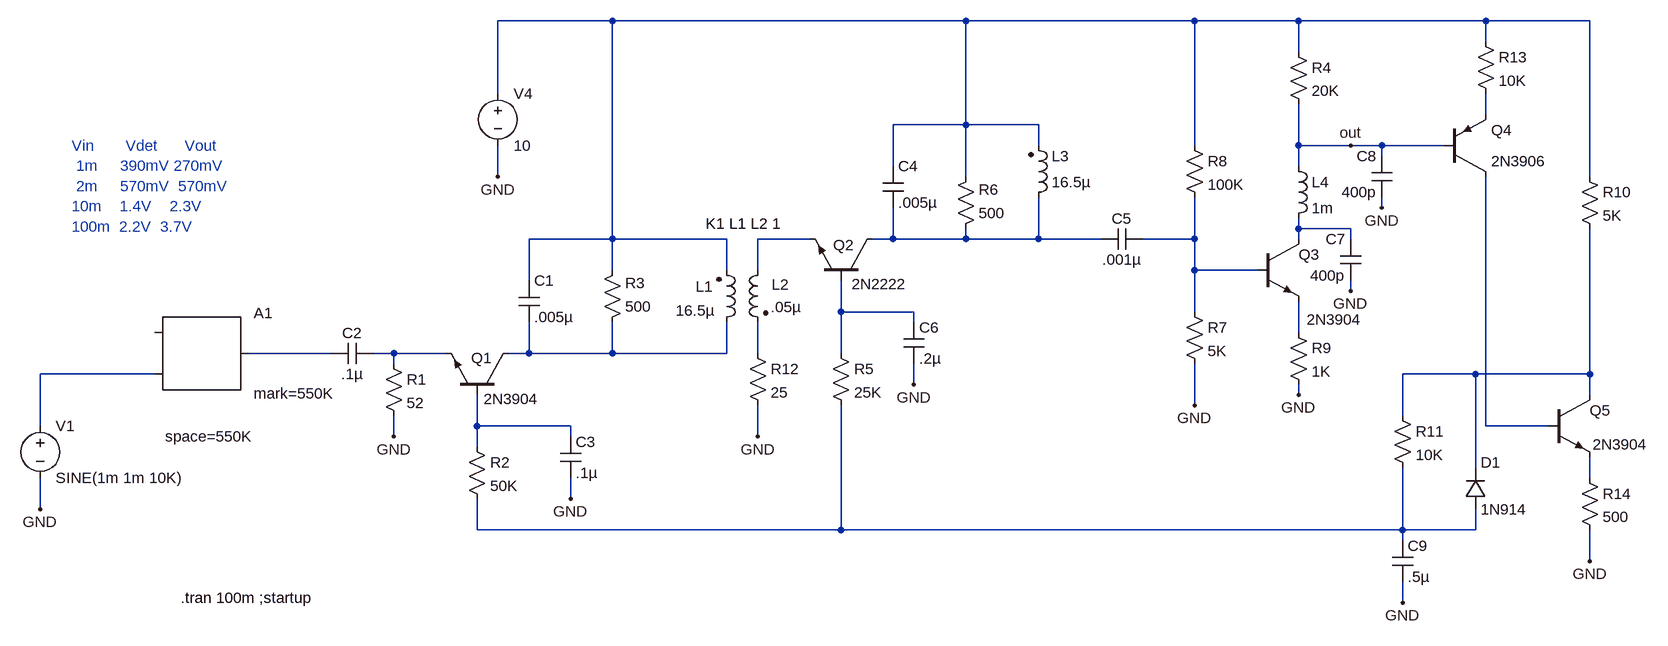
[diagram p0: schematic agc2.asc]
agc2.asc, the LTspice schematic file:
Version 4
SHEET 1 4068 1716
WIRE 2304 1312 2336 1312
WIRE 2640 1312 2640 1264
WIRE 2336 1312 2336 1264
WIRE 2336 1312 2464 1312
WIRE 2336 1136 2464 1136
WIRE 2640 1184 2640 1136
WIRE 2336 1200 2336 1136
WIRE 2208 1312 2128 1312
WIRE 2128 1312 2128 1328
WIRE 2128 1408 2128 1440
WIRE 2128 1312 2096 1312
WIRE 2032 1312 1904 1312
WIRE 1584 1344 1584 1424
WIRE 1584 1504 1584 1552
WIRE 2256 1376 2256 1424
WIRE 2256 1536 2256 1584
WIRE 2256 1424 2256 1456
WIRE 2256 1424 2400 1424
WIRE 2400 1424 2400 1440
WIRE 2400 1504 2400 1536
WIRE 2464 1136 2464 800
WIRE 2464 1136 2640 1136
WIRE 2464 1136 2464 1184
WIRE 2464 1264 2464 1312
WIRE 2464 1312 2640 1312
WIRE 2864 1136 2896 1136
WIRE 3120 1136 3120 1072
WIRE 2896 1136 2896 1088
WIRE 2896 1136 3008 1136
WIRE 2896 960 3008 960
WIRE 3120 992 3120 960
WIRE 2896 1024 2896 960
WIRE 2768 1136 2688 1136
WIRE 2816 1200 2816 1248
WIRE 2816 1248 2816 1312
WIRE 2816 1248 2928 1248
WIRE 2928 1248 2928 1264
WIRE 2928 1328 2928 1360
WIRE 3008 960 3120 960
WIRE 3008 960 3008 1040
WIRE 3008 1120 3008 1136
WIRE 3008 1136 3120 1136
WIRE 2688 1136 2688 1184
WIRE 2688 1264 2688 1312
WIRE 3520 1136 3520 1120
WIRE 3520 1024 3520 992
WIRE 2288 1040 2288 992
WIRE 2288 912 2288 800
WIRE 2288 800 2464 800
WIRE 3520 1376 3520 1360
WIRE 3520 848 3520 800
WIRE 3360 1328 3360 1392
WIRE 3360 1136 3280 1136
WIRE 3520 992 3600 992
WIRE 3520 992 3520 928
WIRE 3600 1216 3600 1200
WIRE 3520 1120 3520 1104
WIRE 3360 1136 3360 1072
WIRE 3520 1280 3520 1232
WIRE 3360 992 3360 800
WIRE 3360 1184 3360 1136
WIRE 3456 1184 3360 1184
WIRE 3360 1184 3360 1248
WIRE 2464 800 3008 800
WIRE 3008 800 3360 800
WIRE 3360 800 3520 800
WIRE 3600 1136 3600 1120
WIRE 3600 1120 3520 1120
WIRE 3680 1584 3680 1600
WIRE 3680 1664 3680 1696
WIRE 1760 1344 1584 1344
WIRE 2816 1392 2816 1584
WIRE 2816 1584 2256 1584
WIRE 3216 1136 3120 1136
WIRE 3808 944 3808 912
WIRE 3808 800 3520 800
WIRE 3808 1040 3808 1424
WIRE 3808 1424 3904 1424
WIRE 3968 1472 3968 1504
WIRE 3680 1584 3680 1488
WIRE 3968 1344 3968 1376
WIRE 3808 800 3968 800
WIRE 3968 800 3968 1040
WIRE 3968 1120 3968 1344
WIRE 3680 1408 3680 1344
WIRE 3808 832 3808 800
WIRE 3968 1584 3968 1632
WIRE 3600 992 3648 992
WIRE 3648 1088 3648 1072
WIRE 3648 1008 3648 992
WIRE 3648 992 3744 992
WIRE 2688 1392 2688 1440
WIRE 3680 1344 3792 1344
WIRE 3792 1344 3792 1488
WIRE 3792 1552 3792 1584
WIRE 3792 1584 3680 1584
WIRE 3008 960 3008 800
WIRE 3792 1344 3968 1344
WIRE 3680 1584 2816 1584
FLAG 2128 1440 GND
FLAG 1584 1552 GND
FLAG 2400 1536 GND
FLAG 2928 1360 GND
FLAG 2688 1440 GND
FLAG 3520 1376 GND
FLAG 2288 1040 GND
FLAG 3360 1392 GND
FLAG 3600 1216 GND
FLAG 3680 1696 GND
FLAG 3968 1632 GND
FLAG 3600 992 out
FLAG 3648 1088 GND
SYMBOL npn 2304 1376 M270
WINDOW 0 57 57 VLeft 0
WINDOW 3 -6 38 VLeft 0
SYMATTR InstName Q1
SYMATTR Value 2N3904
SYMBOL ind2 2624 1280 M180
WINDOW 0 -5 71 Right 0
WINDOW 3 -2 34 Right 0
SYMATTR InstName L1
SYMATTR Value 16.5µ
SYMBOL cap 2320 1264 M180
WINDOW 0 24 64 Left 0
WINDOW 3 24 8 Left 0
SYMATTR InstName C1
SYMATTR Value .005µ
SYMBOL res 2112 1312 R0
SYMATTR InstName R1
SYMATTR Value 52
SYMBOL cap 2096 1296 R90
WINDOW 0 0 32 VBottom 0
WINDOW 3 32 32 VTop 0
SYMATTR InstName C2
SYMATTR Value .1µ
SYMBOL voltage 1584 1408 R0
SYMATTR InstName V1
SYMATTR Value SINE(1m 1m 10K)
SYMBOL res 2240 1440 R0
SYMATTR InstName R2
SYMATTR Value 50K
SYMBOL cap 2384 1440 R0
SYMATTR InstName C3
SYMATTR Value .1µ
SYMBOL res 2448 1280 M180
WINDOW 0 36 76 Left 0
WINDOW 3 36 40 Left 0
SYMATTR InstName R3
SYMATTR Value 500
SYMBOL npn 2864 1200 M270
WINDOW 0 55 60 VLeft 0
WINDOW 3 -5 32 VLeft 0
SYMATTR InstName Q2
SYMATTR Value 2N2222
SYMBOL ind2 3104 1088 M180
WINDOW 0 36 80 Left 0
WINDOW 3 36 40 Left 0
SYMATTR InstName L3
SYMATTR Value 16.5µ
SYMBOL cap 2880 1088 M180
WINDOW 0 24 64 Left 0
WINDOW 3 24 8 Left 0
SYMATTR InstName C4
SYMATTR Value .005µ
SYMBOL res 2800 1296 R0
SYMATTR InstName R5
SYMATTR Value 25K
SYMBOL cap 2912 1264 R0
SYMATTR InstName C6
SYMATTR Value .2µ
SYMBOL res 2992 1136 M180
WINDOW 0 36 76 Left 0
WINDOW 3 36 40 Left 0
SYMATTR InstName R6
SYMATTR Value 500
SYMBOL ind2 2704 1168 M0
WINDOW 0 -5 38 Right 0
WINDOW 3 -4 73 Right 0
SYMATTR InstName L2
SYMATTR Value .05µ
SYMBOL ind 3504 1008 R0
SYMATTR InstName L4
SYMATTR Value 1m
SYMBOL voltage 2288 896 R0
SYMATTR InstName V4
SYMATTR Value 10
SYMBOL res 3504 832 R0
SYMATTR InstName R4
SYMATTR Value 20K
SYMBOL res 3344 1232 R0
SYMATTR InstName R7
SYMATTR Value 5K
SYMBOL cap 3280 1120 R90
WINDOW 0 0 32 VBottom 0
WINDOW 3 32 32 VTop 0
SYMATTR InstName C5
SYMATTR Value .001µ
SYMBOL cap 3616 1200 R180
WINDOW 0 24 64 Left 0
WINDOW 3 24 8 Left 0
SYMATTR InstName C7
SYMATTR Value 400p
SYMBOL npn 3456 1136 R0
WINDOW 0 64 24 Left 0
WINDOW 3 76 124 Left 0
SYMATTR InstName Q3
SYMATTR Value 2N3904
SYMBOL res 3344 976 R0
SYMATTR InstName R8
SYMATTR Value 100K
SYMBOL res 3504 1264 R0
SYMATTR InstName R9
SYMATTR Value 1K
SYMBOL res 3952 1024 R0
SYMATTR InstName R10
SYMATTR Value 5K
SYMBOL cap 3664 1600 R0
SYMATTR InstName C9
SYMATTR Value .5µ
SYMBOL SpecialFunctions\modulate 1760 1280 R0
WINDOW 123 16 160 Left 0
SYMATTR InstName A1
SYMATTR Value mark=550K
SYMATTR Value2 space=550K
SYMBOL pnp 3744 1040 M180
WINDOW 0 72 72 Left 0
WINDOW 3 72 24 Left 0
SYMATTR InstName Q4
SYMATTR Value 2N3906
SYMBOL npn 3904 1376 R0
WINDOW 0 64 24 Left 0
WINDOW 3 68 76 Left 0
SYMATTR InstName Q5
SYMATTR Value 2N3904
SYMBOL res 3664 1392 R0
SYMATTR InstName R11
SYMATTR Value 10K
SYMBOL res 3792 816 R0
SYMATTR InstName R13
SYMATTR Value 10K
SYMBOL res 3952 1488 R0
SYMATTR InstName R14
SYMATTR Value 500
SYMBOL cap 3664 1072 R180
WINDOW 0 24 64 Left 0
WINDOW 3 24 8 Left 0
SYMATTR InstName C8
SYMATTR Value 400p
SYMBOL res 2672 1296 R0
SYMATTR InstName R12
SYMATTR Value 25
SYMBOL diode 3776 1552 M180
WINDOW 0 24 72 Left 0
WINDOW 3 24 0 Left 0
SYMATTR InstName D1
SYMATTR Value 1N914
text 1800 1688 Left 0 !.tran 100m ;startup
text 2608 1112 Left 0 !K1 L1 L2 1
text 1632 992 Left 0 ;Vin       Vdet      Vout\n 1m     390mV 270mV\n 2m     570mV  570mV\n10m    1.4V    2.3V\n100m  2.2V  3.7V

The netlist it stands for:
* agc2.asc
Q1 N001 N006 N003 0 2N3904
L1 N001 N002 16.5µ
C1 N001 N002 .005µ
R1 N003 GND 52
C2 N003 N004 .1µ
V1 N005 GND SINE(1m 1m 10K)
R2 N006 N007 50K
C3 N006 GND .1µ
R3 N001 N002 500
Q2 N008 N010 N009 0 2N2222
L3 N008 N002 16.5µ
C4 N008 N002 .005µ
R5 N010 N007 25K
C6 N010 GND .2µ
R6 N008 N002 500
L2 N009 N011 .05µ
L4 out N012 1m
V4 N002 GND 10
R4 N002 out 20K
R7 N013 GND 5K
C5 N013 N008 .001µ
C7 GND N012 400p
Q3 N012 N013 N014 0 2N3904
R8 N002 N013 100K
R9 N014 GND 1K
R10 N002 N018 5K
C9 N007 GND .5µ
A1 0 N005 0 0 0 0 N004 0 MODULATOR mark=550K space=550K
Q4 N016 out N015 0 2N3906
Q5 N018 N016 N017 0 2N3904
R11 N018 N007 10K
R13 N002 N015 10K
R14 N017 GND 500
C8 GND out 400p
R12 N011 GND 25
D1 N007 N018 1N914
.model D D
.lib standard.dio
.model NPN NPN
.model PNP PNP
.lib standard.bjt
.tran 100m ;startup
K1 L1 L2 1
* Vin       Vdet      Vout
*  1m     390mV 270mV
*  2m     570mV  570mV
* 10m    1.4V    2.3V
* 100m  2.2V  3.7V
.backanno
.end